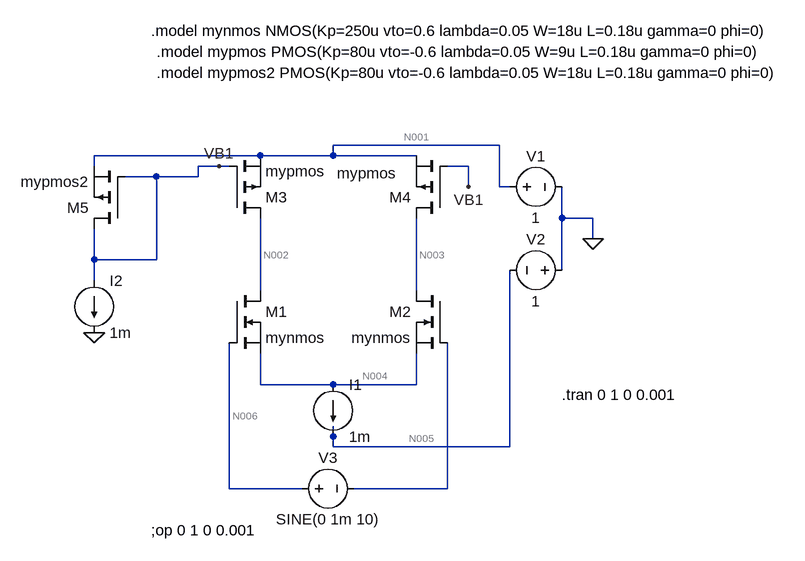
[diagram p0: schematic 3.asc]
3.asc, the LTspice schematic file:
Version 4
SHEET 1 1268 704
WIRE 352 32 96 32
WIRE -16 48 -272 48
WIRE 96 48 96 32
WIRE 96 48 -16 48
WIRE 224 48 96 48
WIRE -272 64 -272 48
WIRE -80 64 -112 64
WIRE -64 64 -80 64
WIRE 304 64 272 64
WIRE -176 80 -224 80
WIRE -112 80 -112 64
WIRE -112 80 -176 80
WIRE 304 96 304 64
WIRE 352 96 352 32
WIRE 368 96 352 96
WIRE 448 144 448 96
WIRE 496 144 448 144
WIRE 496 176 496 144
WIRE -272 208 -272 160
WIRE -176 208 -176 80
WIRE -176 208 -272 208
WIRE 448 224 448 144
WIRE -272 240 -272 208
WIRE -16 256 -16 144
WIRE 224 256 224 144
WIRE -16 400 -16 352
WIRE 96 400 -16 400
WIRE 224 400 224 352
WIRE 224 400 96 400
WIRE 96 480 96 464
WIRE 96 496 96 480
WIRE 368 496 368 224
WIRE 368 496 96 496
WIRE -64 560 -64 336
WIRE 48 560 -64 560
WIRE 272 560 272 336
WIRE 272 560 128 560
FLAG 496 176 0
FLAG 304 96 VB1
FLAG -80 64 VB1
FLAG -272 320 0
DATAFLAG 224 192 ""
DATAFLAG -16 208 ""
DATAFLAG 160 400 ""
DATAFLAG -144 80 ""
DATAFLAG 64 48 ""
DATAFLAG 304 64 ""
SYMBOL nmos -64 256 R0
SYMATTR InstName M1
SYMATTR Value mynmos
SYMBOL nmos 272 256 M0
SYMATTR InstName M2
SYMATTR Value mynmos
SYMBOL pmos -64 144 M180
SYMATTR InstName M3
SYMATTR Value mypmos
SYMBOL pmos 272 144 R180
WINDOW 3 79 69 Left 2
SYMATTR Value mypmos
SYMATTR InstName M4
SYMBOL voltage 352 96 R270
WINDOW 0 32 56 VTop 2
WINDOW 3 -32 56 VBottom 2
WINDOW 123 0 0 Left 0
WINDOW 39 0 0 Left 0
SYMATTR InstName V1
SYMATTR Value 1
SYMBOL voltage 464 224 R90
WINDOW 0 -32 56 VBottom 2
WINDOW 3 32 56 VTop 2
WINDOW 123 0 0 Left 0
WINDOW 39 0 0 Left 0
SYMATTR InstName V2
SYMATTR Value 1
SYMBOL current 96 400 R0
WINDOW 123 0 0 Left 0
WINDOW 39 0 0 Left 0
SYMATTR InstName I1
SYMATTR Value 1m
SYMBOL voltage 32 560 R270
WINDOW 0 32 56 VTop 2
WINDOW 3 -32 56 VBottom 2
WINDOW 123 0 0 Left 0
WINDOW 39 0 0 Left 0
SYMATTR InstName V3
SYMATTR Value SINE(0 1m 10)
SYMBOL pmos -224 160 R180
SYMATTR InstName M5
SYMATTR Value mypmos2
SYMBOL current -272 240 R0
WINDOW 123 0 0 Left 0
WINDOW 39 0 0 Left 0
SYMATTR InstName I2
SYMATTR Value 1m
TEXT -184 -144 Left 2 !.model mynmos NMOS(Kp=250u vto=0.6 lambda=0.05 W=18u L=0.18u gamma=0 phi=0)
TEXT -184 624 Left 2 !;op 0 1 0 0.001
TEXT 448 416 Left 2 !.tran 0 1 0 0.001
TEXT -176 -112 Left 2 !.model mypmos PMOS(Kp=80u vto=-0.6 lambda=0.05 W=9u L=0.18u gamma=0 phi=0)
TEXT -176 -80 Left 2 !.model mypmos2 PMOS(Kp=80u vto=-0.6 lambda=0.05 W=18u L=0.18u gamma=0 phi=0)

The netlist it stands for:
* 3.asc
M1 N002 N006 N004 N004 mynmos
M2 N003 N007 N004 N004 mynmos
M3 N002 VB1 N001 N001 mypmos
M4 N003 VB1 N001 N001 mypmos
V1 N001 0 1
V2 0 N005 1
I1 N004 N005 1m
V3 N006 N007 SINE(0 1m 10)
M5 VB1 VB1 N001 N001 mypmos2
I2 VB1 0 1m
.model NMOS NMOS
.model PMOS PMOS
.lib standard.mos
.model mynmos NMOS(Kp=250u vto=0.6 lambda=0.05 W=18u L=0.18u gamma=0 phi=0)
;op 0 1 0 0.001
.tran 0 1 0 0.001
.model mypmos PMOS(Kp=80u vto=-0.6 lambda=0.05 W=9u L=0.18u gamma=0 phi=0)
.model mypmos2 PMOS(Kp=80u vto=-0.6 lambda=0.05 W=18u L=0.18u gamma=0 phi=0)
.backanno
.end

* Results of the author's LTspice run, read from the files saved beside the schematic
* Operating Point, zero values left out:
*   V(n002) = -86.94 mV
*   V(n004) = -796.5 mV
*   V(n003) = -86.94 mV
*   V(vb1) = -86.94 mV
*   V(n001) = 1 V
*   V(n005) = -1 V
*   Id(M5) = -1 mA
*   Ib(M5) = 1.097 pA
*   Is(M5) = 1 mA
*   Id(M4) = -500 µA
*   Ib(M4) = 1.097 pA
*   Is(M4) = 500 µA
*   Id(M3) = -500 µA
*   Ib(M3) = 1.097 pA
*   Is(M3) = 500 µA
*   Id(M2) = 500 µA
*   Is(M2) = -500 µA
*   Id(M1) = 500 µA
*   Is(M1) = -500 µA
*   I(I2) = 1 mA
*   I(I1) = 1 mA
*   I(V2) = -1 mA
*   I(V1) = -2 mA
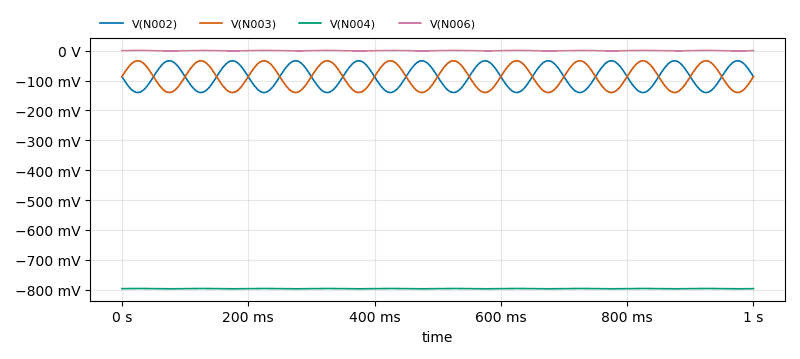
[diagram p1: Transient Analysis of 3.asc, plotted from the saved traces]
* Transient Analysis, 1 run:
*   V(N002): min -140 mV, max -33.83 mV, average -86.94 mV, rms 94.8 mV, last -86.94 mV
*   V(N003): min -140.1 mV, max -33.84 mV, average -86.94 mV, rms 94.8 mV, last -86.94 mV
*   V(N004): min -797 mV, max -796 mV, average -796.5 mV, rms 796.5 mV, last -796.5 mV
*   V(N006): min -1 mV, max 1 mV, average 8.021 nV, rms 711.3 µV, last 0 V